# Altium schematic sheet GPIO_Header.SchDoc: Title
size A4; Date: *******; ApprovedBy: *******; CheckedBy: None; Author: *******; CompanyName: *******; DrawnBy: Name; Engineer: *******; Organization: *******; Address1: *******; Address2: *******; Address3: *******; Address4: *******; DocumentNumber: 9; Revision: *******; SheetNumber: 9; SheetTotal: 11; CurrentTime: *******; CurrentDate: *******; Time: *******; DocumentFullPathAndName: *******; DocumentName: *******; ModifiedDate: *******; ImagePath: *******; ProjectName: *******; Application_BuildNumber: *******
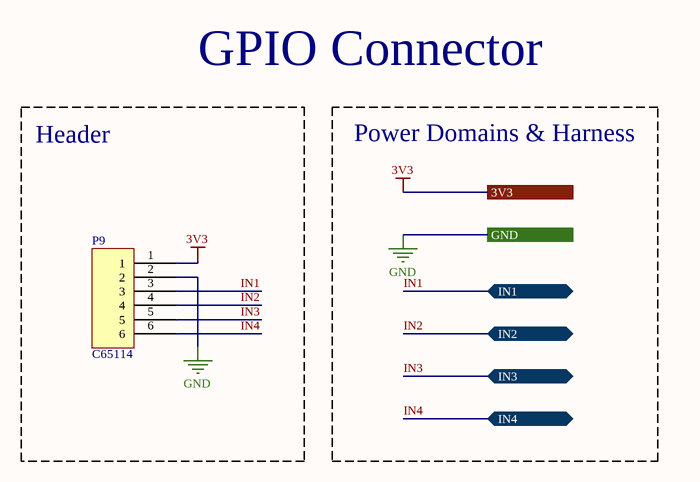
[diagram p0: GPIO_Header.SchDoc]

## Parts
P9  Manufacturer Part Number: C65114  [HEADER 3X2]  (hidden comment: HEADER 6POS)

## Blocks framed on the sheet
Header: P9

## Ports
3V3 (see Lens-Maker[1C], A4988[3B], ESP32_Block[3C], ESP32_Module[3B], I2C_Header[3B], Power[3B], SPI_Header[3B], Stepper_Driver[3A]), GND (see Lens-Maker[1D], A4988[3B], ESP32_Block[3D], ESP32_Module[3B], I2C_Header[3B], Mechanical_Holes[3B], Power[3C], SPI_Header[3B], Stepper_Driver[3B], USB_Connector[3B]), IN1 (bidir, see Lens-Maker[2C]), IN2 (bidir, see Lens-Maker[2C]), IN3 (bidir, see Lens-Maker[2C]), IN4 (bidir, see Lens-Maker[2C])

## Nets
3V3: P9.1 ; port 3V3
GND: P9.2 ; port GND
IN1: P9.3 ; port IN1
IN2: P9.4 ; port IN2
IN3: P9.5 ; port IN3
IN4: P9.6 ; port IN4

## Notes on the sheet
- GPIO Connector
- Power Domains & Harness
- Title:
- Size:
- Date:
- Drawn By:
- Page Contents:
- A4
- Checked By:
- Revision:
- Sheet
- of

## Library data of the parts
P9 = HEADER 6POS: Straight 2 6 2.54mm Black Straight,P=2.54mm  Pin Headers ROHS; Manufacturer: BOOMELE(Boom Precision Elec); Supplier: JLCPCB; Supplier Part Number: C65114